# Altium schematic sheet garmin-gps-module-eval-board.SchDoc
size A
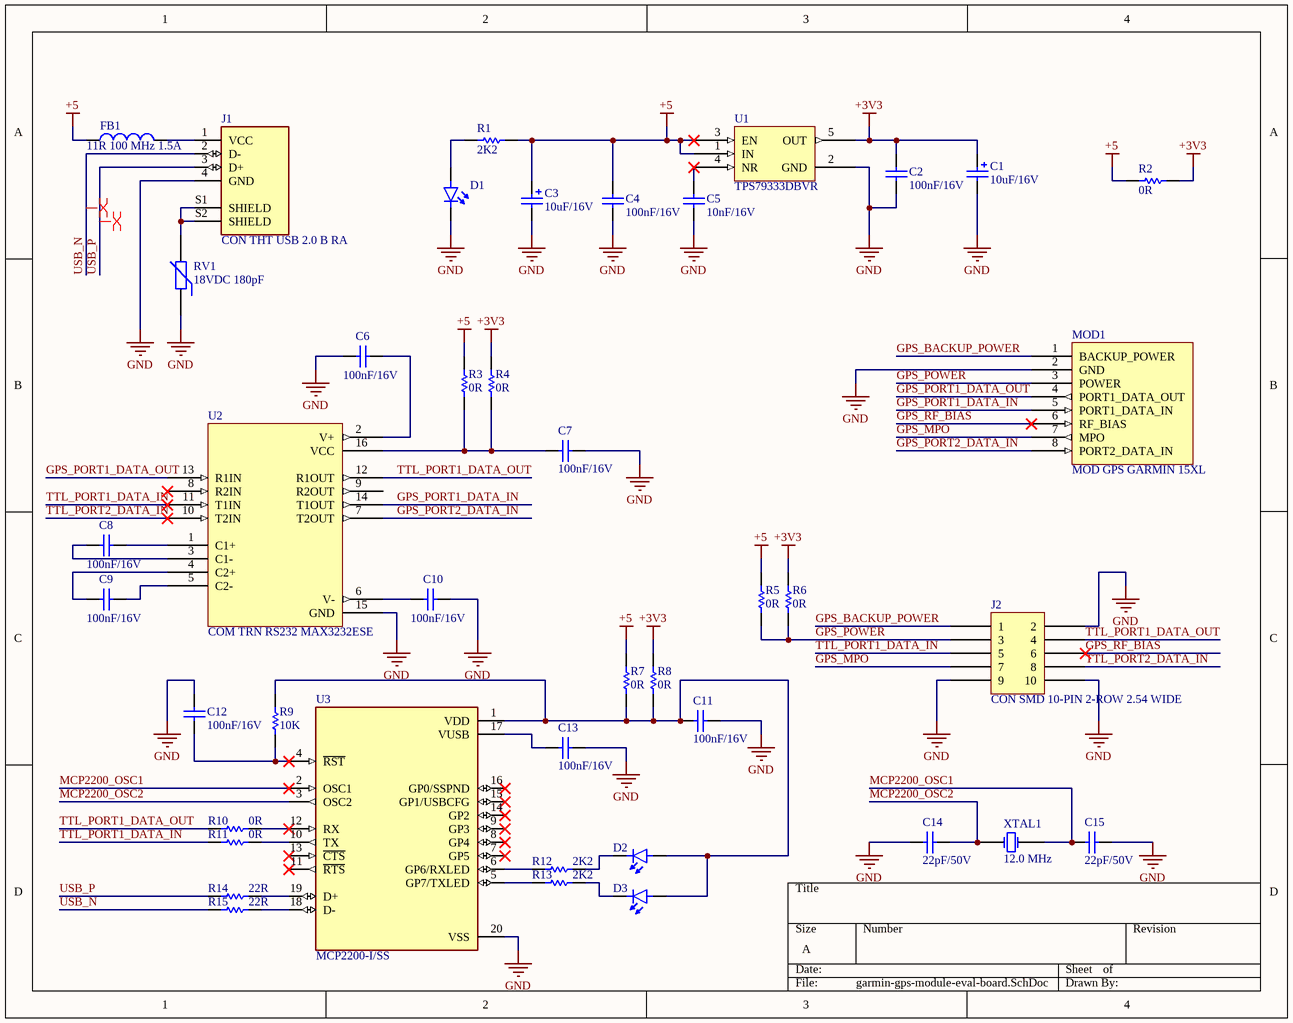
[diagram p0: garmin-gps-module-eval-board.SchDoc]

## Parts
C1  10uF/16V  [SMD 1206 POLARIZED]
C2  100nF/16V  [SMD 0603 GENERIC]
C3  10uF/16V  [SMD 1206 POLARIZED]
C4  100nF/16V  [SMD 0603 GENERIC]
C5  10nF/16V  [SMD 0603 GENERIC]
C6  100nF/16V  [SMD 0603 GENERIC]
C7  100nF/16V  [SMD 0603 GENERIC]
C8  100nF/16V  [SMD 0603 GENERIC]
C9  100nF/16V  [SMD 0603 GENERIC]
C10  100nF/16V  [SMD 0603 GENERIC]
C11  100nF/16V  [SMD 0603 GENERIC]
C12  100nF/16V  [SMD 0603 GENERIC]
C13  100nF/16V  [SMD 0603 GENERIC]
C14  22pF/50V  [SMD 0805 GENERIC]
C15  22pF/50V  [SMD 0805 GENERIC]
D1  1N4007  [SMD 0603 LED]  (value not drawn)
D2  1N4007  [SMD 0603 LED]  (value not drawn)
D3  1N4007  [SMD 0603 LED]  (value not drawn)
FB1  11R 100 MHz 1.5A  [SMD 0805 GENERIC]
J1  CON THT USB 2.0 B RA  [THT CON USB 2.0 RA]
J2  CON SMD 10-PIN 2-ROW 2.54 WIDE  [SMD HEADER 2x5 2.54 WIDE]
MOD1  MOD GPS GARMIN 15XL  [THT MOD GPS GARMIN 15XH/15XL]
R1  2K2  [SMD 0805 GENERIC]
R2  0R  [SMD 0603 GENERIC]
R3  0R  [SMD 0603 GENERIC]
R4  0R  [SMD 0603 GENERIC]
R5  0R  [SMD 0603 GENERIC]
R6  0R  [SMD 0603 GENERIC]
R7  0R  [SMD 0603 GENERIC]
R8  0R  [SMD 0603 GENERIC]
R9  10K  [SMD 0603 GENERIC]
R10  0R  [SMD 0603 GENERIC]
R11  0R  [SMD 0603 GENERIC]
R12  2K2  [SMD 0805 GENERIC]
R13  2K2  [SMD 0805 GENERIC]
R14  22R  [SMD 0603 GENERIC]
R15  22R  [SMD 0603 GENERIC]
RV1  18VDC 180pF  [SMD 0805 GENERIC]
U1  TPS79333DBVR  [SOT23-5]
U2  COM TRN RS232 MAX3232ESE  [SMD SOIC-16]
U3  MCP2200-I/SS  [SMD SSOP-20]
XTAL1  12.0 MHz  [THT XTAL HC49]

## Nets
+3V3: C1.1 C2.2 R2.1 R4.2 R6.2 R8.2 U1.5(OUT)
+5: C3.1 C4.2 FB1.1 R1.2 R2.2 R3.2 R5.2 R7.2 U1.1(IN) U1.3(EN)
GND: C1.2 C2.1 C3.2 C4.1 C5.1 C6.2 C7.1 C10.1 C11.1 C12.1 C13.2 C14.1 C15.2 D1.K J1.4(GND) J2.2 J2.9 J2.10 MOD1.2(GND) RV1.1 U1.2(GND) U2.15(GND) U3.20(VSS)
GPS_BACKUP_POWER: J2.1 MOD1.1(BACKUP_POWER)
GPS_MPO: J2.7 MOD1.7(MPO)
GPS_PORT1_DATA_IN: MOD1.5(PORT1_DATA_IN) U2.14(T1OUT)
GPS_PORT1_DATA_OUT: MOD1.4(PORT1_DATA_OUT) U2.13(R1IN)
GPS_PORT2_DATA_IN: MOD1.8(PORT2_DATA_IN) U2.7(T2OUT)
GPS_POWER: J2.3 MOD1.3(POWER) R5.1 R6.1
GPS_RF_BIAS: J2.6 MOD1.6(RF_BIAS)
MCP2200_OSC1: C15.1 U3.2(OSC1) XTAL1.1(OSC1)
MCP2200_OSC2: C14.2 U3.3(OSC2) XTAL1.2(OSC2)
TTL_PORT1_DATA_IN: J2.5 R11.2 U2.11(T1IN)
TTL_PORT1_DATA_OUT: J2.4 R10.2 U2.12(R1OUT)
TTL_PORT2_DATA_IN: J2.8 U2.10(T2IN)
USB_N: J1.2(D-) R15.1
USB_P: J1.3(D+) R14.1
NetC5_2: C5.2 U1.4(NR)
NetC6_1: C6.1 U2.2(V+)
NetC7_2: C7.2 R3.1 R4.1 U2.16(VCC)
NetC8_1: C8.1 U2.1(C1+)
NetC8_2: C8.2 U2.3(C1-)
NetC9_1: C9.1 U2.5(C2-)
NetC9_2: C9.2 U2.4(C2+)
NetC10_2: C10.2 U2.6(V-)
NetC11_2: C11.2 D2.A D3.A R7.1 R8.1 R9.2 U3.1(VDD)
NetC12_2: C12.2 R9.1 U3.4(~{RST})
NetC13_1: C13.1 U3.17(VUSB)
NetD1_A: D1.A R1.1
NetD2_K: D2.K R12.2
NetD3_K: D3.K R13.2
NetFB1_2: FB1.2 J1.1(VCC)
NetJ1_S1: J1.S1(SHIELD) J1.S2(SHIELD) RV1.2
NetR10_1: R10.1 U3.12(RX)
NetR11_1: R11.1 U3.10(TX)
NetR12_1: R12.1 U3.6(GP6/RXLED)
NetR13_1: R13.1 U3.5(GP7/TXLED)
NetR14_2: R14.2 U3.19(D+)
NetR15_2: R15.2 U3.18(D-)

Not connected (* = marked no-connect by the designer): U2 8(R2IN)* 9(R2OUT); U3 7(GP5)* 8(GP4)* 9(GP3)* 11(~{RTS})* 13(~{CTS})* 14(GP2)* 15(GP1/USBCFG)* 16(GP0/SSPND)*

## Layout directives
differential pair: USB_N, USB_P

## Library data of the parts
C1 C3 = CAP SMD TAN 10uF 16V 10% 1206
C2 C4 C6-C13 = CAP SMD CER 100nF 16V 10% X7R 0603
C5 = CAP SMD CER 10nF 16V 10% X7R 0603
C14 C15 = CAP SMD CER 22pF 50V 5% C0G 0805
D1-D3 = SEM GEN LED 0603
FB1 = FBD SMD 11R 100MHz 1.5A 0805
J1 = CON THT USB 2.0 B RA: USB-B (USB TYPE-B) USB 2.0 Receptacle Connector 4 Position Through Hole, Right Angle
J2 = CON SMD 10-PIN 2-ROW 2.54 WIDE: HTST-105-01-SM-DV-P
R1 R12 R13 = RES SMD 2K2 1% 0805
R2-R8 R10 R11 = RES SMD 0R 0603
R9 = RES SMD 10K 1% 0603
R14 R15 = RES SMD 22R 1% 0603
RV1 = VAR SMD 18VDC 180pF 0805
U1 = PWR TPS79333DBVR
U3 = COM TRN UART MCP2200-I/SS
XTAL1 = XTAL THT 12.0 MHz HC49